# Altium schematic sheet Schematics.SchDoc: Li-ion/Li-po Charger Circuit
size A4; Organization: Altium Limited; Address1: L3, 12a Rodborough Rd; Address2: Frenchs Forest; Address3: NSW; Address4: Australia 2086; DocumentNumber: 1; Revision: V1; SheetNumber: 1; SheetTotal: 1
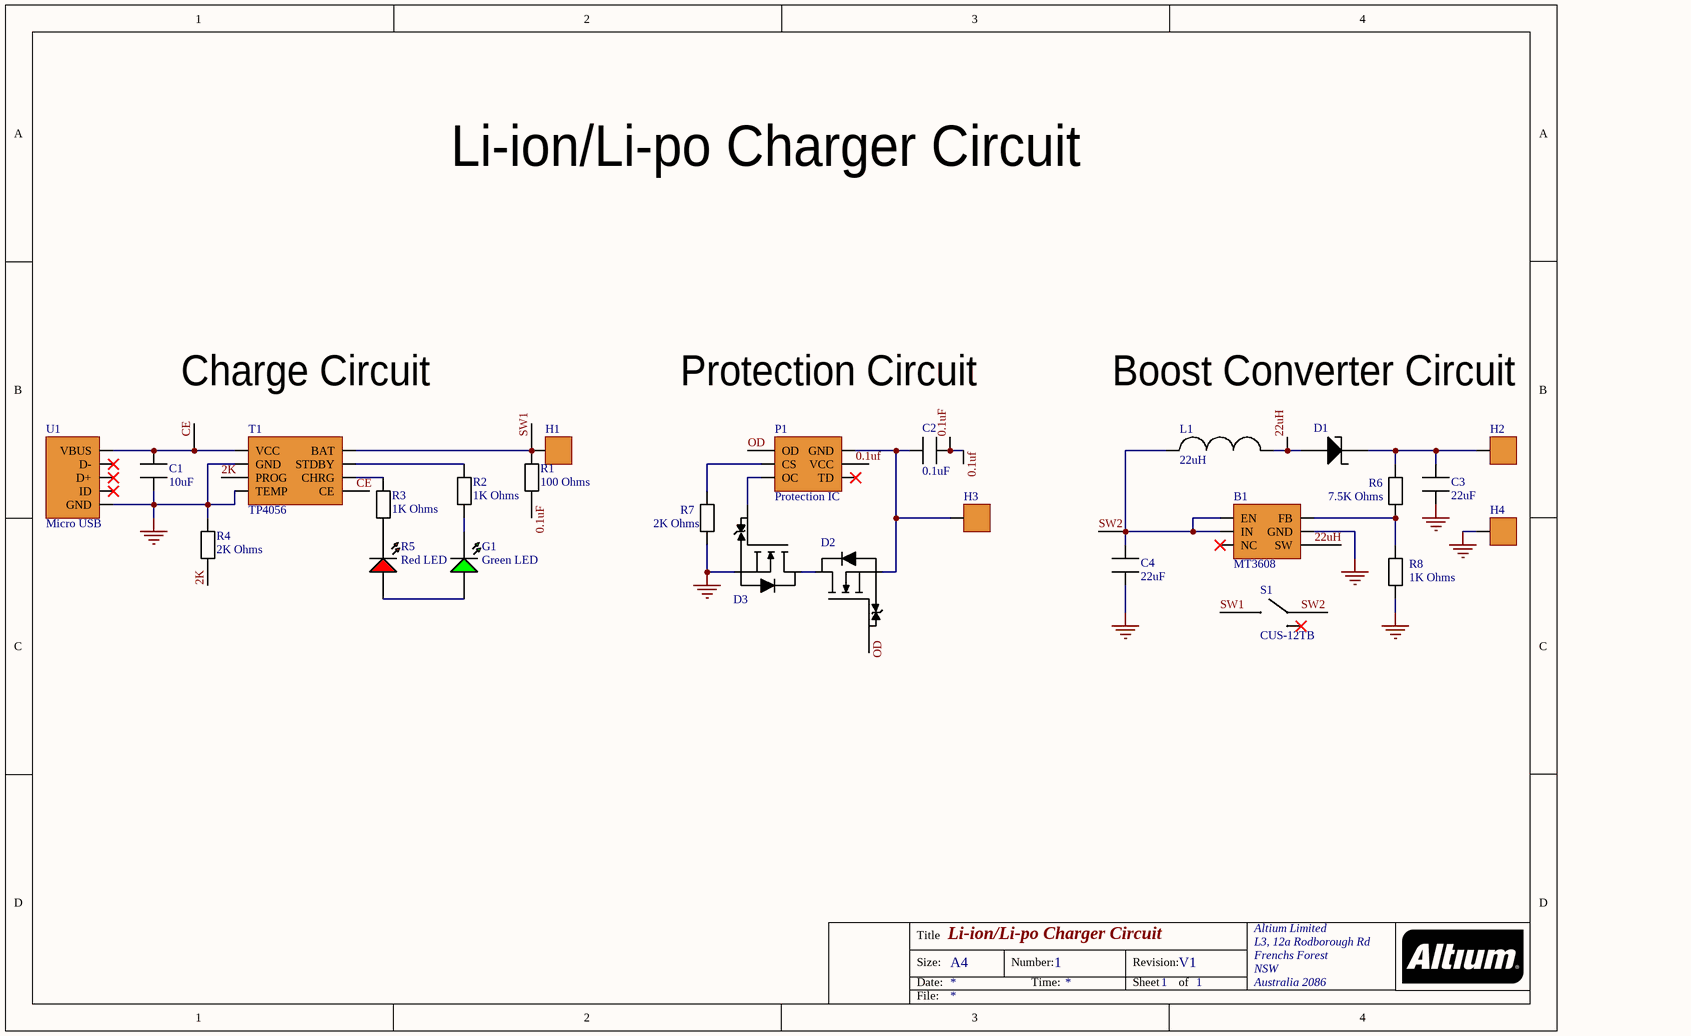
[diagram p0: Schematics.SchDoc]

## Parts
B1  MT3608  [Boost Converter]
C1  10uF  [10uF Capacitor]
C2  0.1uF  [0.1uF Capacitor]
C3  22uF  [22uF Capacitor]
C4  22uF  [22uF Capacitor]
D1  Schottky Diode  [Diode]  (value not drawn)
D2  N-Channel MOSFET  [MOSFET]  (value not drawn)
D3  N-Channel MOSFET  [MOSFET]  (value not drawn)
G1  Green LED  [Green LED]
H1  1x1 Header  [Header 1x1]  (value not drawn)
H2  1x1 Header  [Header 1x1]  (value not drawn)
H3  1x1 Header  [Header 1x1]  (value not drawn)
H4  1x1 Header  [Header 1x1]  (value not drawn)
L1  22uH  [22uH Inductor]
P1  Protection IC  [Protection IC]
R1  100 Ohms  [100 Ohms]
R2  1K Ohms  [1K Resistor]
R3  1K Ohms  [1K Resistor]
R4  2K Ohms  [2K Resistor]
R5  Red LED  [Red LED]
R6  7.5K Ohms  [7.5K Resistor]
R7  2K Ohms  [2K Resistor]
R8  1K Ohms  [1K Resistor]
S1  CUS-12TB  [Slide Switch]
T1  TP4056  [TP4056]
U1  Micro USB  [Micro USB]

## Nets
GND: B1.2(GND) C1.1 C3.1 C4.1 D3.3(S) H4.1 R4.1 R7.1 R8.1 T1.1(TEMP) T1.3(GND) U1.5(GND)
0.1uf: C2.2 P1.5(VCC) R1.1
2K: R4.2 T1.2(PROG)
22uH: B1.1(SW) D1.2 L1.2
CE: C1.2 T1.4(VCC) T1.8(CE) U1.1(VBUS)
OD: D2.1(G) P1.1(OD)
SW1: H1.1 R1.2 S1.1 T1.5(BAT)
SW2: B1.4(EN) B1.5(IN) C4.2 L1.1 S1.2
NetB1_3: B1.3(FB) R6.1 R8.2
NetC2_1: C2.1 D2.3(S) H3.1 P1.6(GND)
NetC3_2: C3.2 D1.1 H2.1 R6.2
NetD2_2: D2.2(D) D3.2(D)
NetD3_1: D3.1(G) P1.3(OC)
NetG1_1: G1.1 R2.1
NetG1_2: G1.2 R5.2
NetP1_2: P1.2(CS) R7.2
NetR2_2: R2.2 T1.6(STDBY)
NetR3_1: R3.1 R5.1
NetR3_2: R3.2 T1.7(CHRG)

Not connected (* = marked no-connect by the designer): B1 6(NC)*; P1 4(TD)*; S1 3*; U1 2(D-)* 3(D+)* 4(ID)*

## Notes on the sheet
- Charge Circuit
- Protection Circuit
- Boost Converter Circuit
- Title
- Size:
- Date:
- A4
- Number:
- Time:
- Revision:
- Sheet
- of
- File:

## Library data of the parts
B1 = MT3608: BOOST CONVERTER IC
C1 = CC0805ZKY5V5BB106: Cap Ceramic 10uF 6.3V Y5V -20% to 80% Pad SMD 0805 85C Automotive T/R; Manufacturer: Yageo; Supplier 1: Digi-Key; Manufacturer Part Number: CC0805ZKY5V5BB106; RoHS: Yes; Category: Ceramic Capacitors; Stock 1: 41988; Pricing 1: 1=0.18000, 10=0.12600, 50=0.07560, 100=0.06380, 500=0.04364, 1000=0.03861 (USD); Mount: Surface Mount; Case/Package: 0805; Number of Pins: 2; Case Code (Metric): 2012; Case Code (Imperial): 0805; Min Operating Temperature: -30°C; Max Operating Temperature: 85°C; Package Quantity: 1; Capacitance: 10uF; Voltage Rating: 6.3V; Tolerance: 80%; Packaging: Tape and Reel; Voltage Rating (DC): 6.3V; Dielectric: Y5V; Composition: Ceramic; Length: 2mm; Height: 1.25mm; Width: 0.049inch; Thickness: 0.057inch; Depth: 1.25mm; Radiation Hardening: No; Lead Free: Lead Free; Halogen Free: Halogen Free; ComponentLink1URL: https://datasheet.ciiva.com/180/mlccorderingcode-180353.pdf?src-supplier=Digi-Key; ComponentLink1Description: https://datasheet.ciiva.com/180/mlccorderingcode-180353.pdf?src-supplier=Digi-Key; ComponentLink2URL: https://datasheet.ciiva.com/180/mlccorderingcode-180354.pdf?src-supplier=Digi-Key; ComponentLink2Description: https://datasheet.ciiva.com/180/mlccorderingcode-180354.pdf?src-supplier=Digi-Key; ComponentLink3URL: https://datasheet.ciiva.com/180/mlccorderingcode-180355.pdf?src-supplier=Digi-Key; ComponentLink3Description: https://datasheet.ciiva.com/180/mlccorderingcode-180355.pdf?src-supplier=Digi-Key; ComponentLink4URL: https://datasheet.ciiva.com/11465/upy-gphc-y5v-6-3v-to-50v-5-11465830.pdf?src-supplier=Avnet; ComponentLink4Description: https://datasheet.ciiva.com/11465/upy-gphc-y5v-6-3v-to-50v-5-11465830.pdf?src-supplier=Avnet; ComponentLink5URL: https://datasheet.ciiva.com/17436/upy-gphc-y5v-6-3v-to-50v-5-17436535.pdf?src-supplier=Avnet+Europe; ComponentLink5Description: https://datasheet.ciiva.com/17436/upy-gphc-y5v-6-3v-to-50v-5-17436535.pdf?src-supplier=Avnet+Europe; ComponentLink6URL: https://datasheet.ciiva.com/13211/upy-gp-np0-16v-to-50v-8-13211102.pdf?src-supplier=Mouser; ComponentLink6Description: https://datasheet.ciiva.com/13211/upy-gp-np0-16v-to-50v-8-13211102.pdf?src-supplier=Mouser; Supplier Part Number 1: 311-1462-1-ND
C2 = GCM21BR72A104KA37L: CAP CER 0.1UF 100V X7R 0805; Manufacturer: Murata; Capacitance: 100nF; Tolerance: 10%; Supplier 1: Digi-Key; Manufacturer Part Number: GCM21BR72A104KA37L; RoHS: Yes; Category: Ceramic Capacitors; Stock 1: 11397818; Pricing 1: 1=0.31000, 10=0.20900, 50=0.13940, 100=0.11850, 500=0.08366, 1000=0.07321 (USD); Mount: Surface Mount; Case/Package: 0805; Case Code (Metric): 2012; Case Code (Imperial): 0805; Min Operating Temperature: -55°C; Max Operating Temperature: 125°C; Package Quantity: 1; Packaging: Tape and Reel; Termination: SMD/SMT; Voltage Rating: 100V; Dielectric: X7R; Voltage Rating (DC): 100V; Voltage: 100V; Length: 2mm; Height: 1.25mm; Depth: 1.25mm; Width: 0.049inch; Thickness: 0.055inch; Ratings: AEC-Q200; Radiation Hardening: No; REACH SVHC: No SVHC; Lead Free: Lead Free; ComponentLink1URL: https://datasheet.ciiva.com/2989/product-2989248.pdf?src-supplier=Avnet; ComponentLink1Description: https://datasheet.ciiva.com/2989/product-2989248.pdf?src-supplier=Avnet; ComponentLink2URL: https://datasheet.ciiva.com/18183/getdatasheetpartid-248062-18183712.pdf?src-supplier=Verical; ComponentLink2Description: https://datasheet.ciiva.com/18183/getdatasheetpartid-248062-18183712.pdf?src-supplier=Verical; ComponentLink3URL: https://datasheet.ciiva.com/11786/0900766b80ef92d0-11786205.pdf?src-supplier=RSComponents; ComponentLink3Description: https://datasheet.ciiva.com/11786/0900766b80ef92d0-11786205.pdf?src-supplier=RSComponents; ComponentLink4URL: https://datasheet.ciiva.com/135/product-135646.pdf?src-supplier=Digi-Key; ComponentLink4Description: https://datasheet.ciiva.com/135/product-135646.pdf?src-supplier=Digi-Key; ComponentLink5URL: https://datasheet.ciiva.com/135/product-135647.pdf?src-supplier=Digi-Key; ComponentLink5Description: https://datasheet.ciiva.com/135/product-135647.pdf?src-supplier=Digi-Key; ComponentLink6URL: https://datasheet.ciiva.com/135/product-135648.pdf?src-supplier=Digi-Key; ComponentLink6Description: https://datasheet.ciiva.com/135/product-135648.pdf?src-supplier=Digi-Key; ComponentLink7URL: https://datasheet.ciiva.com/48671/product-48671358.pdf?src-supplier=Avnet; ComponentLink7Description: https://datasheet.ciiva.com/48671/product-48671358.pdf?src-supplier=Avnet; ComponentLink8URL: https://datasheet.ciiva.com/16449/product-16449295.pdf?src-supplier=Future+Electronics; ComponentLink8Description: https://datasheet.ciiva.com/16449/product-16449295.pdf?src-supplier=Future+Electronics; Supplier Part Number 1: 490-4789-1-ND
C3 C4 = GRM188C80J226ME15D: CAP CER 22UF 6.3V X6S 0603; Manufacturer: Murata; Tolerance: 20%; Supplier 1: Digi-Key; Manufacturer Part Number: GRM188C80J226ME15D; RoHS: Yes; Category: Ceramic Capacitors; Stock 1: 219534; Pricing 1: 1=0.32000, 10=0.21900, 50=0.14560, 100=0.12380, 500=0.08742, 1000=0.07648 (USD); Mount: Surface Mount; Case/Package: 0603; Weight: 0.000222oz; Case Code (Metric): 1608; Case Code (Imperial): 0603; Min Operating Temperature: -55°C; Max Operating Temperature: 105°C; Dielectric: X6S; Termination: SMD/SMT; Voltage Rating (DC): 6.3V; Package Quantity: 4000; Packaging: Tape and Reel; Voltage Rating: 6.3V; Capacitance: 22uF; Length: 0.063inch; Height: 0.8mm; Width: 0.8mm; Thickness: 0.039inch; Lead Free: Lead Free; ComponentLink1URL: http://www.mouser.com/ds/2/281/c02e-2905.pdf?src-supplier=Mouser; ComponentLink1Description: http://www.mouser.com/ds/2/281/c02e-2905.pdf?src-supplier=Mouser; ComponentLink2URL: http://search.murata.co.jp/Ceramy/image/img/A01X/partnumbering_e_01.pdf?src-supplier=Digi-Key; ComponentLink2Description: http://search.murata.co.jp/Ceramy/image/img/A01X/partnumbering_e_01.pdf?src-supplier=Digi-Key; ComponentLink3URL: http://search.murata.co.jp/Ceramy/image/img/A01X/G101/ENG/GRM188C80J226ME15-01.pdf?src-supplier=Digi-Key; ComponentLink3Description: http://search.murata.co.jp/Ceramy/image/img/A01X/G101/ENG/GRM188C80J226ME15-01.pdf?src-supplier=Digi-Key; Supplier Part Number 1: 490-10471-1-ND
D1 = SDM03U40-7: Diode Schottky 40V 0.03A 2Pin SOD523; Manufacturer: Diodes; Max Power Dissipation: 150mW; Forward Current: 30mA; Peak Reverse Current: 500nA; Forward Voltage: 370mV; Peak Non-Repetitive Surge Current: 200mA; Element Configuration: Single; Polarity: Standard; Capacitance: 6pF; Max Reverse Voltage (DC): 30V; Supplier 1: Digi-Key; Manufacturer Part Number: SDM03U40-7; RoHS: Yes; Category: Rectifier Diodes; Stock 1: 40570; Pricing 1: 1=0.20000, 10=0.13600, 100=0.07270, 500=0.04166, 1000=0.03485 (USD); Mount: Surface Mount; Number of Pins: 2; Weight: 3.5E-05oz; Min Operating Temperature: -40°C; Max Operating Temperature: 125°C; Package Quantity: 3000; Packaging: Tape and Reel; Average Rectified Current: 30mA; Max Repetitive Reverse Voltage (Vrrm): 40V; Max Forward Surge Current (Ifsm): 200mA; Power Dissipation: 150mW; Termination: SMD/SMT; Voltage Rating (DC): 40V; Power Rating: 150mW; Current Rating: 30mA; Output Current: 30mA; Length: 1.3mm; Height: 0.65mm; Width: 0.9mm; Radiation Hardening: No; Lead Free: Lead Free; ComponentLink1URL: https://datasheet.ciiva.com/4715/ds30392-87516-4715617.pdf?src-supplier=Mouser; ComponentLink1Description: https://datasheet.ciiva.com/4715/ds30392-87516-4715617.pdf?src-supplier=Mouser; ComponentLink2URL: https://datasheet.ciiva.com/8301/ds30392-8301153.pdf?src-supplier=Avnet; ComponentLink2Description: https://datasheet.ciiva.com/8301/ds30392-8301153.pdf?src-supplier=Avnet; ComponentLink3URL: https://datasheet.ciiva.com/15144/getdatasheetpartid-38927-15144053.pdf?src-supplier=Verical; ComponentLink3Description: https://datasheet.ciiva.com/15144/getdatasheetpartid-38927-15144053.pdf?src-supplier=Verical; ComponentLink4URL: https://datasheet.ciiva.com/912/ds30392-912843.pdf?src-supplier=Digi-Key; ComponentLink4Description: https://datasheet.ciiva.com/912/ds30392-912843.pdf?src-supplier=Digi-Key; ComponentLink5URL: https://datasheet.ciiva.com/912/ds30392-912844.pdf?src-supplier=Digi-Key; ComponentLink5Description: https://datasheet.ciiva.com/912/ds30392-912844.pdf?src-supplier=Digi-Key; ComponentLink6URL: https://datasheet.ciiva.com/912/ds30392-912845.pdf?src-supplier=Digi-Key; ComponentLink6Description: https://datasheet.ciiva.com/912/ds30392-912845.pdf?src-supplier=Digi-Key; Supplier Part Number 1: SDM03U40DICT-ND
D2 D3 = DMN65D8L-7: N-Channel Enhancement MOSFET SOT-23; Manufacturer: Diodes; FET Type: 1 N-Channel; Number of Channels: 1; Rise Time: 2.8ns; Rds On Max: 3R; Input Capacitance: 22pF; Element Configuration: Single; Gate to Source Voltage (Vgs): 20V; Drain to Source Voltage (Vdss): 60V; Continuous Drain Current (ID): 310mA; Max Power Dissipation: 370mW; Drain to Source Resistance: 2R; Power Dissipation: 540mW; Turn-Off Delay Time: 12.6ns; Turn-On Delay Time: 2.7ns; Threshold Voltage: 2V; Supplier 1: Digi-Key; Manufacturer Part Number: DMN65D8L-7; RoHS: Yes; Category: MOSFETs; Stock 1: 211297; Pricing 1: 1=0.17000, 10=0.15100, 25=0.14400, 100=0.06330, 250=0.06076, 500=0.04972, 1000=0.03453 (USD); Mount: Surface Mount; Case/Package: SOT-23; Number of Pins: 3; Weight: 0.000282oz; Min Operating Temperature: -55°C; Max Operating Temperature: 150°C; Packaging: Tape and Reel; Package Quantity: 1; Drain to Source Breakdown Voltage: 60V; Number of Elements: 1; Length: 3mm; Height: 1.1mm; Width: 1.4mm; Lead Free: Lead Free; REACH SVHC: No SVHC; ComponentLink1URL: https://datasheet.ciiva.com/6371/dmn65d8l-6371124.pdf?src-supplier=Digi-Key; ComponentLink1Description: https://datasheet.ciiva.com/6371/dmn65d8l-6371124.pdf?src-supplier=Digi-Key; ComponentLink2URL: https://datasheet.ciiva.com/13058/dmn65d8l-219098-13058455.pdf?src-supplier=Mouser; ComponentLink2Description: https://datasheet.ciiva.com/13058/dmn65d8l-219098-13058455.pdf?src-supplier=Mouser; ComponentLink3URL: https://datasheet.ciiva.com/6371/dmn65d8l-6371126.pdf?src-supplier=Digi-Key; ComponentLink3Description: https://datasheet.ciiva.com/6371/dmn65d8l-6371126.pdf?src-supplier=Digi-Key; ComponentLink4URL: https://datasheet.ciiva.com/6371/dmn65d8l-6371128.pdf?src-supplier=Digi-Key; ComponentLink4Description: https://datasheet.ciiva.com/6371/dmn65d8l-6371128.pdf?src-supplier=Digi-Key; Supplier Part Number 1: DMN65D8L-7DICT-ND
G1 = 150080GS75000: SMD LED green 3.5 V 0805, 150080GS75000, Würth Elektronik; Manufacturer: Wurth Electronics; Viewing Angle: 140°; Lens Style: Clear,Rectangular; Luminous Intensity: 450mcd; Forward Voltage: 3.2V; Wavelength: 520nm; Forward Current: 30mA; Test Current: 20mA; Supplier 1: Digi-Key; Manufacturer Part Number: 150080GS75000; RoHS: Yes; Category: LEDs; Stock 1: 23160; Pricing 1: 1=0.18000, 50=0.16500, 100=0.14200, 500=0.12300 (USD); Mount: Surface Mount; Case/Package: 0805; Color: Green; Case Code (Metric): 2012; Case Code (Imperial): 0805; Min Operating Temperature: -40°C; Max Operating Temperature: 85°C; Package Quantity: 4000; Packaging: Cut Tape; Dominant Wavelength: 520nm; Length: 2mm; Height: 0.7mm; Width: 1.25mm; REACH SVHC: Unknown; ComponentLink1URL: https://datasheet.ciiva.com/29563/150080gs75000-29563008.pdf?src-supplier=Digi-Key; ComponentLink1Description: https://datasheet.ciiva.com/29563/150080gs75000-29563008.pdf?src-supplier=Digi-Key; ComponentLink2URL: https://datasheet.ciiva.com/29279/759434-da-01-en-chipled-0805-w-kl-gruen-150080gs75000-29279039.pdf?src-supplier=Conrad; ComponentLink2Description: https://datasheet.ciiva.com/29279/759434-da-01-en-chipled-0805-w-kl-gruen-150080gs75000-29279039.pdf?src-supplier=Conrad; Supplier Part Number 1: 732-4983-1-ND
H1-H4 = 61300111121: CONN HEADER VERT 1POS; Manufacturer: Wurth Electronics; Number of Positions: 1; Gender: Male; Connector Type: Male Pin; Supplier 1: Digi-Key; Manufacturer Part Number: 61300111121; RoHS: Yes; Category: Connectors; Stock 1: 9604; Pricing 1: 1=0.13000, 10=0.10600, 25=0.08800, 50=0.07400, 100=0.06700, 1000=0.06100 (USD); Mount: Through Hole; Contact Plating: Gold; Contact Material: Copper; Color: Black; Packaging: Bulk; Number of Rows: 1; Termination: Solder; Number of Contacts: 1; Contact Mating Length: 0.236inch; REACH SVHC: Unknown; ComponentLink1URL: http://www.farnell.com/cad/1737268.pdf?src-supplier=Element14; ComponentLink1Description: http://www.farnell.com/cad/1737268.pdf?src-supplier=Element14; ComponentLink2URL: https://katalog.we-online.de/em/datasheet/6130xx11121.pdf?src-supplier=Digi-Key; ComponentLink2Description: https://katalog.we-online.de/em/datasheet/6130xx11121.pdf?src-supplier=Digi-Key; Supplier Part Number 1: 732-5314-ND
L1 = 7447714220: Ind Power Shielded Wirewound 22uH 20% 100KHz Ferrite 3A T/R; Manufacturer: Wurth Electronics; Saturation Current: 3.6A; Self Resonant Frequency: 14.5MHz; Resistance: 50mR; Supplier 1: Digi-Key; Manufacturer Part Number: 7447714220; RoHS: Yes; Category: Fixed Inductors; Stock 1: 7442; Pricing 1: 1=2.12000, 10=2.03800, 50=1.84000, 100=1.65000, 250=1.51000 (USD); Mount: Surface Mount; Case/Package: Nonstandard; Core Material: Ferrite; Min Operating Temperature: -40°C; Max Operating Temperature: 125°C; Package Quantity: 500; Packaging: Cut Tape; Current Rating: 3A; Tolerance: 20%; Shielding: Shielded; Inductance Tolerance: 20%; Inductance: 22uH; Composition: Wirewound; DC Resistance (DCR): 50mR; Test Frequency: 100kHz; Max DC Current: 3A; Termination: SMD/SMT; RMS Current (Irms): 3A; Series Resistance: 50mR; Length: 10mm; Height: 5mm; Width: 10mm; Height - Seated (Max): 0.197inch; Depth: 10mm; REACH SVHC: Unknown; ComponentLink1URL: https://datasheet.ciiva.com/1058/7447714220-1058608.pdf?src-supplier=Digi-Key; ComponentLink1Description: https://datasheet.ciiva.com/1058/7447714220-1058608.pdf?src-supplier=Digi-Key; ComponentLink2URL: https://datasheet.ciiva.com/30489/0900766b81281c0b-30489748.pdf?src-supplier=RSComponents; ComponentLink2Description: https://datasheet.ciiva.com/30489/0900766b81281c0b-30489748.pdf?src-supplier=RSComponents; ComponentLink3URL: https://datasheet.ciiva.com/13320/7447714220-70113-13320863.pdf?src-supplier=Mouser; ComponentLink3Description: https://datasheet.ciiva.com/13320/7447714220-70113-13320863.pdf?src-supplier=Mouser; ComponentLink4URL: https://datasheet.ciiva.com/1058/7447714220-1058609.pdf?src-supplier=Digi-Key; ComponentLink4Description: https://datasheet.ciiva.com/1058/7447714220-1058609.pdf?src-supplier=Digi-Key; ComponentLink5URL: https://datasheet.ciiva.com/7691/1736273-7691674.pdf?src-supplier=Element14; ComponentLink5Description: https://datasheet.ciiva.com/7691/1736273-7691674.pdf?src-supplier=Element14; ComponentLink6URL: https://datasheet.ciiva.com/48691/001087798-da-01-ml-we-pd-smd-speicherdrossel-74477142-de-en-48691509.pdf?src-supplier=Conrad; ComponentLink6Description: https://datasheet.ciiva.com/48691/001087798-da-01-ml-we-pd-smd-speicherdrossel-74477142-de-en-48691509.pdf?src-supplier=Conrad; Supplier Part Number 1: 732-2992-1-ND
P1 = FS312F-G
R1 = RNCP0805FTD100R: RES SMD 100 OHM 1% 1/4W 0805; Manufacturer: Stackpole Electronics; Resistance: 100R; Max Power Dissipation: 250mW; Temperature Coefficient: 100ppm/°C; Supplier 1: Digi-Key; Manufacturer Part Number: RNCP0805FTD100R; RoHS: Yes; Category: Chip SMD Resistors; Stock 1: 171227; Pricing 1: 1=0.10000, 10=0.06600, 100=0.02550, 1000=0.01120, 2500=0.00967 (USD); Mount: Surface Mount; Case/Package: 0805; Case Code (Imperial): 0805; Case Code (Metric): 2012; Min Operating Temperature: -55°C; Max Operating Temperature: 155°C; Composition: Thin Film; Number of Terminations: 2; Features: Moisture Resistant,Anti-Sulfur; Tolerance: 1%; Packaging: Tape and Reel; Length: 0.079inch; Height: 0.024inch; Width: 0.049inch; Lead Free: Lead Free; ComponentLink1URL: http://www.seielect.com/Catalog/SEI-rncp.pdf?src-supplier=Digi-Key; ComponentLink1Description: http://www.seielect.com/Catalog/SEI-rncp.pdf?src-supplier=Digi-Key; ComponentLink2URL: https://www.seielect.com/catalog/SEI-Packaging.pdf?src-supplier=Digi-Key; ComponentLink2Description: https://www.seielect.com/catalog/SEI-Packaging.pdf?src-supplier=Digi-Key; Supplier Part Number 1: RNCP0805FTD100RCT-ND
R2 R3 R8 = RNCP0805FTD1K00: RES 1K OHM 1% 1/4W 0805; Manufacturer: Stackpole Electronics; Max Power Dissipation: 250mW; Temperature Coefficient: 100ppm/°C; Resistance: 1kR; Supplier 1: Digi-Key; Manufacturer Part Number: RNCP0805FTD1K00; RoHS: Yes; Category: Chip SMD Resistors; Stock 1: 425201; Pricing 1: 1=0.10000, 10=0.06600, 100=0.02550, 1000=0.01120, 2500=0.00967 (USD); Mount: Surface Mount; Case/Package: 0805; Case Code (Metric): 2012; Case Code (Imperial): 0805; Min Operating Temperature: -55°C; Max Operating Temperature: 155°C; Features: Moisture Resistant,Anti-Sulfur; Composition: Thin Film; Number of Terminations: 2; Tolerance: 1%; Power Rating: 250mW; Packaging: Tape and Reel; Length: 0.079inch; Height: 0.024inch; Width: 0.049inch; Lead Free: Lead Free; ComponentLink1URL: http://www.seielect.com/Catalog/SEI-rncp.pdf?src-supplier=Future+Electronics; ComponentLink1Description: http://www.seielect.com/Catalog/SEI-rncp.pdf?src-supplier=Future+Electronics; ComponentLink2URL: https://www.seielect.com/catalog/SEI-Packaging.pdf?src-supplier=Digi-Key; ComponentLink2Description: https://www.seielect.com/catalog/SEI-Packaging.pdf?src-supplier=Digi-Key; ComponentLink3URL: https://www.seielect.com/Catalog/SEI-rncp.pdf?src-supplier=Digi-Key; ComponentLink3Description: https://www.seielect.com/Catalog/SEI-rncp.pdf?src-supplier=Digi-Key; Supplier Part Number 1: RNCP0805FTD1K00CT-ND
R4 R7 = RNCF0805TKY2K00: RES SMD 2K OHM 0.01% 1/8W 0805; Manufacturer: Stackpole Electronics; Max Power Dissipation: 125mW; Temperature Coefficient: 5ppm/°C; Resistance: 2kR; Supplier 1: Digi-Key; Manufacturer Part Number: RNCF0805TKY2K00; RoHS: Yes; Category: Chip SMD Resistors; Stock 1: 3852; Pricing 1: 1=1.97000, 10=1.74900, 100=1.33560 (USD); Mount: Surface Mount; Case/Package: 0805; Case Code (Imperial): 0805; Case Code (Metric): 2012; Min Operating Temperature: -55°C; Max Operating Temperature: 155°C; Tolerance: 0.01%; Packaging: Tape and Reel; Composition: Thin Film; Number of Terminations: 2; Features: Moisture Resistant; Length: 0.079inch; Height: 0.026inch; Width: 0.049inch; ComponentLink1URL: https://www.seielect.com/Catalog/SEI-RNCF.pdf?src-supplier=Digi-Key; ComponentLink1Description: https://www.seielect.com/Catalog/SEI-RNCF.pdf?src-supplier=Digi-Key; ComponentLink2URL: https://www.seielect.com/catalog/SEI-Packaging.pdf?src-supplier=Digi-Key; ComponentLink2Description: https://www.seielect.com/catalog/SEI-Packaging.pdf?src-supplier=Digi-Key; Supplier Part Number 1: RNCF0805TKY2K00CT-ND
R5 = 150080RS75000: SMD LED red 2.4 V 0805, 150080RS75000, Würth Elektronik; Manufacturer: Wurth Electronics; Luminous Intensity: 150mcd; Viewing Angle: 140°; Forward Voltage: 2V; Wavelength: 625nm; Lens Style: Clear,Rectangular; Forward Current: 30mA; Test Current: 20mA; Supplier 1: Digi-Key; Manufacturer Part Number: 150080RS75000; RoHS: Yes; Category: LEDs; Stock 1: 60927; Pricing 1: 1=0.18000, 50=0.16500, 100=0.14200, 500=0.12300 (USD); Mount: Surface Mount; Case/Package: 0805; Color: Red; Case Code (Metric): 2012; Case Code (Imperial): 0805; Min Operating Temperature: -40°C; Max Operating Temperature: 85°C; Package Quantity: 4000; Packaging: Tape and Reel; Dominant Wavelength: 625nm; Length: 2mm; Height: 0.7mm; Width: 1.25mm; REACH SVHC: Unknown; ComponentLink1URL: https://datasheet.ciiva.com/22656/150080rs75000-22656961.pdf?src-supplier=Element14; ComponentLink1Description: https://datasheet.ciiva.com/22656/150080rs75000-22656961.pdf?src-supplier=Element14; ComponentLink2URL: https://datasheet.ciiva.com/29279/759435-da-01-en-chipled-0805-w-kl-rot-150080rs75000-29279032.pdf?src-supplier=Conrad; ComponentLink2Description: https://datasheet.ciiva.com/29279/759435-da-01-en-chipled-0805-w-kl-rot-150080rs75000-29279032.pdf?src-supplier=Conrad; Supplier Part Number 1: 732-4984-1-ND
R6 = RNCP0805FTD7K50: RES SMD 7.5K OHM 1% 1/4W 0805; Manufacturer: Stackpole Electronics; Max Power Dissipation: 250mW; Temperature Coefficient: 100ppm/°C; Resistance: 7.5kR; Supplier 1: Digi-Key; Manufacturer Part Number: RNCP0805FTD7K50; RoHS: Yes; Category: Chip SMD Resistors; Stock 1: 16530; Pricing 1: 1=0.10000, 10=0.06900, 100=0.02640, 1000=0.01162, 2500=0.01003 (USD); Mount: Surface Mount; Case/Package: 0805; Case Code (Imperial): 0805; Case Code (Metric): 2012; Min Operating Temperature: -55°C; Max Operating Temperature: 155°C; Tolerance: 1%; Packaging: Tape and Reel; Composition: Thin Film; Number of Terminations: 2; Features: Moisture Resistant,Anti-Sulfur; Length: 0.079inch; Height: 0.024inch; Width: 0.049inch; ComponentLink1URL: http://www.seielect.com/Catalog/SEI-rncp.pdf?src-supplier=Digi-Key; ComponentLink1Description: http://www.seielect.com/Catalog/SEI-rncp.pdf?src-supplier=Digi-Key; ComponentLink2URL: https://www.seielect.com/catalog/SEI-Packaging.pdf?src-supplier=Digi-Key; ComponentLink2Description: https://www.seielect.com/catalog/SEI-Packaging.pdf?src-supplier=Digi-Key; Supplier Part Number 1: RNCP0805FTD7K50CT-ND
S1 = CUS-12TB: SWITCH SLIDE SPDT 300MA 4V; Manufacturer: Nidec Copal; Actuator Material: Nylon,Polyamide; Switch Travel: 1.5mm; Contact Style: Non-Shorting; Electrical Life: 10000Cycles; Switch Function: On-On; Operating Force: 204gf; Max Voltage Rating (DC): 20V; Actuator Type: Standard; Supplier 1: Digi-Key; Manufacturer Part Number: CUS-12TB; RoHS: Yes; Category: Slide Switches; Stock 1: 15160; Pricing 1: 1=0.70000, 10=0.67000, 25=0.64400, 100=0.55890, 250=0.50996, 500=0.47390, 1000=0.42496 (USD); Mount: Surface Mount; Contact Material: Copper Alloy; Contact Plating: Gold; Min Operating Temperature: -20°C; Max Operating Temperature: 70°C; Termination: Gull Wing; Current Rating: 300mA; Packaging: Tape and Reel; Throw Configuration: SPDT; Voltage Rating (DC): 4V; Orientation: Right Angle; Actuator Length: 1.5mm; Radiation Hardening: No; ComponentLink1URL: https://datasheet.ciiva.com/2889/cus-2889431.pdf?src-supplier=Digi-Key; ComponentLink1Description: https://datasheet.ciiva.com/2889/cus-2889431.pdf?src-supplier=Digi-Key; ComponentLink2URL: https://datasheet.ciiva.com/2889/cus-2889432.pdf?src-supplier=Digi-Key; ComponentLink2Description: https://datasheet.ciiva.com/2889/cus-2889432.pdf?src-supplier=Digi-Key; ComponentLink3URL: https://datasheet.ciiva.com/2889/cus-2889433.pdf?src-supplier=Digi-Key; ComponentLink3Description: https://datasheet.ciiva.com/2889/cus-2889433.pdf?src-supplier=Digi-Key; Supplier Part Number 1: 563-1102-1-ND
T1 = TP4056: Li-ION/LI-PO CHARGE IC
U1 = 629105136821: WURTH ELEKTRONIK - 629105136821 - Connecteur USB, Micro USB Type B, USB 2.0, Embase, 5 Voies, Montage en surface, Coudée; Manufacturer: Wurth Electronics; Plating: Nickel; Current Rating: 1.8A; Gender: Receptacle; Voltage Rating: 30V; Number of Contacts: 5; Insulation Resistance: 1GR; Number of Ports: 1; USB Standard: USB 2.0; Supplier 1: Digi-Key; Manufacturer Part Number: 629105136821; RoHS: Yes; Category: Connectors; Stock 1: 8625; Pricing 1: 1=1.21000, 10=1.19200, 50=1.10700, 100=1.02100, 500=0.93600 (USD); Mount: Surface Mount,Horizontal; Contact Plating: Gold; Contact Material: Copper Alloy; Color: Black; Min Operating Temperature: -40°C; Max Operating Temperature: 105°C; Package Quantity: 1400; Packaging: Tape and Reel; Connector Type: USB; Number of Positions: 5; Termination: Solder; Orientation: Right Angle; Length: 5.9mm; Lead Free: Lead Free; REACH SVHC: Unknown; Flammability Rating: UL94 V-0; ComponentLink1URL: https://datasheet.ciiva.com/851/629105136821-851196.pdf?src-supplier=Digi-Key; ComponentLink1Description: https://datasheet.ciiva.com/851/629105136821-851196.pdf?src-supplier=Digi-Key; ComponentLink2URL: https://datasheet.ciiva.com/12494/629105136821-221118-12494781.pdf?src-supplier=Mouser; ComponentLink2Description: https://datasheet.ciiva.com/12494/629105136821-221118-12494781.pdf?src-supplier=Mouser; ComponentLink3URL: https://datasheet.ciiva.com/851/629105136821-851197.pdf?src-supplier=Digi-Key; ComponentLink3Description: https://datasheet.ciiva.com/851/629105136821-851197.pdf?src-supplier=Digi-Key; ComponentLink4URL: https://datasheet.ciiva.com/851/629105136821-851198.pdf?src-supplier=Digi-Key; ComponentLink4Description: https://datasheet.ciiva.com/851/629105136821-851198.pdf?src-supplier=Digi-Key; Supplier Part Number 1: 732-3155-1-ND